# EAGLE design wdt (EAGLE 7.2.0)
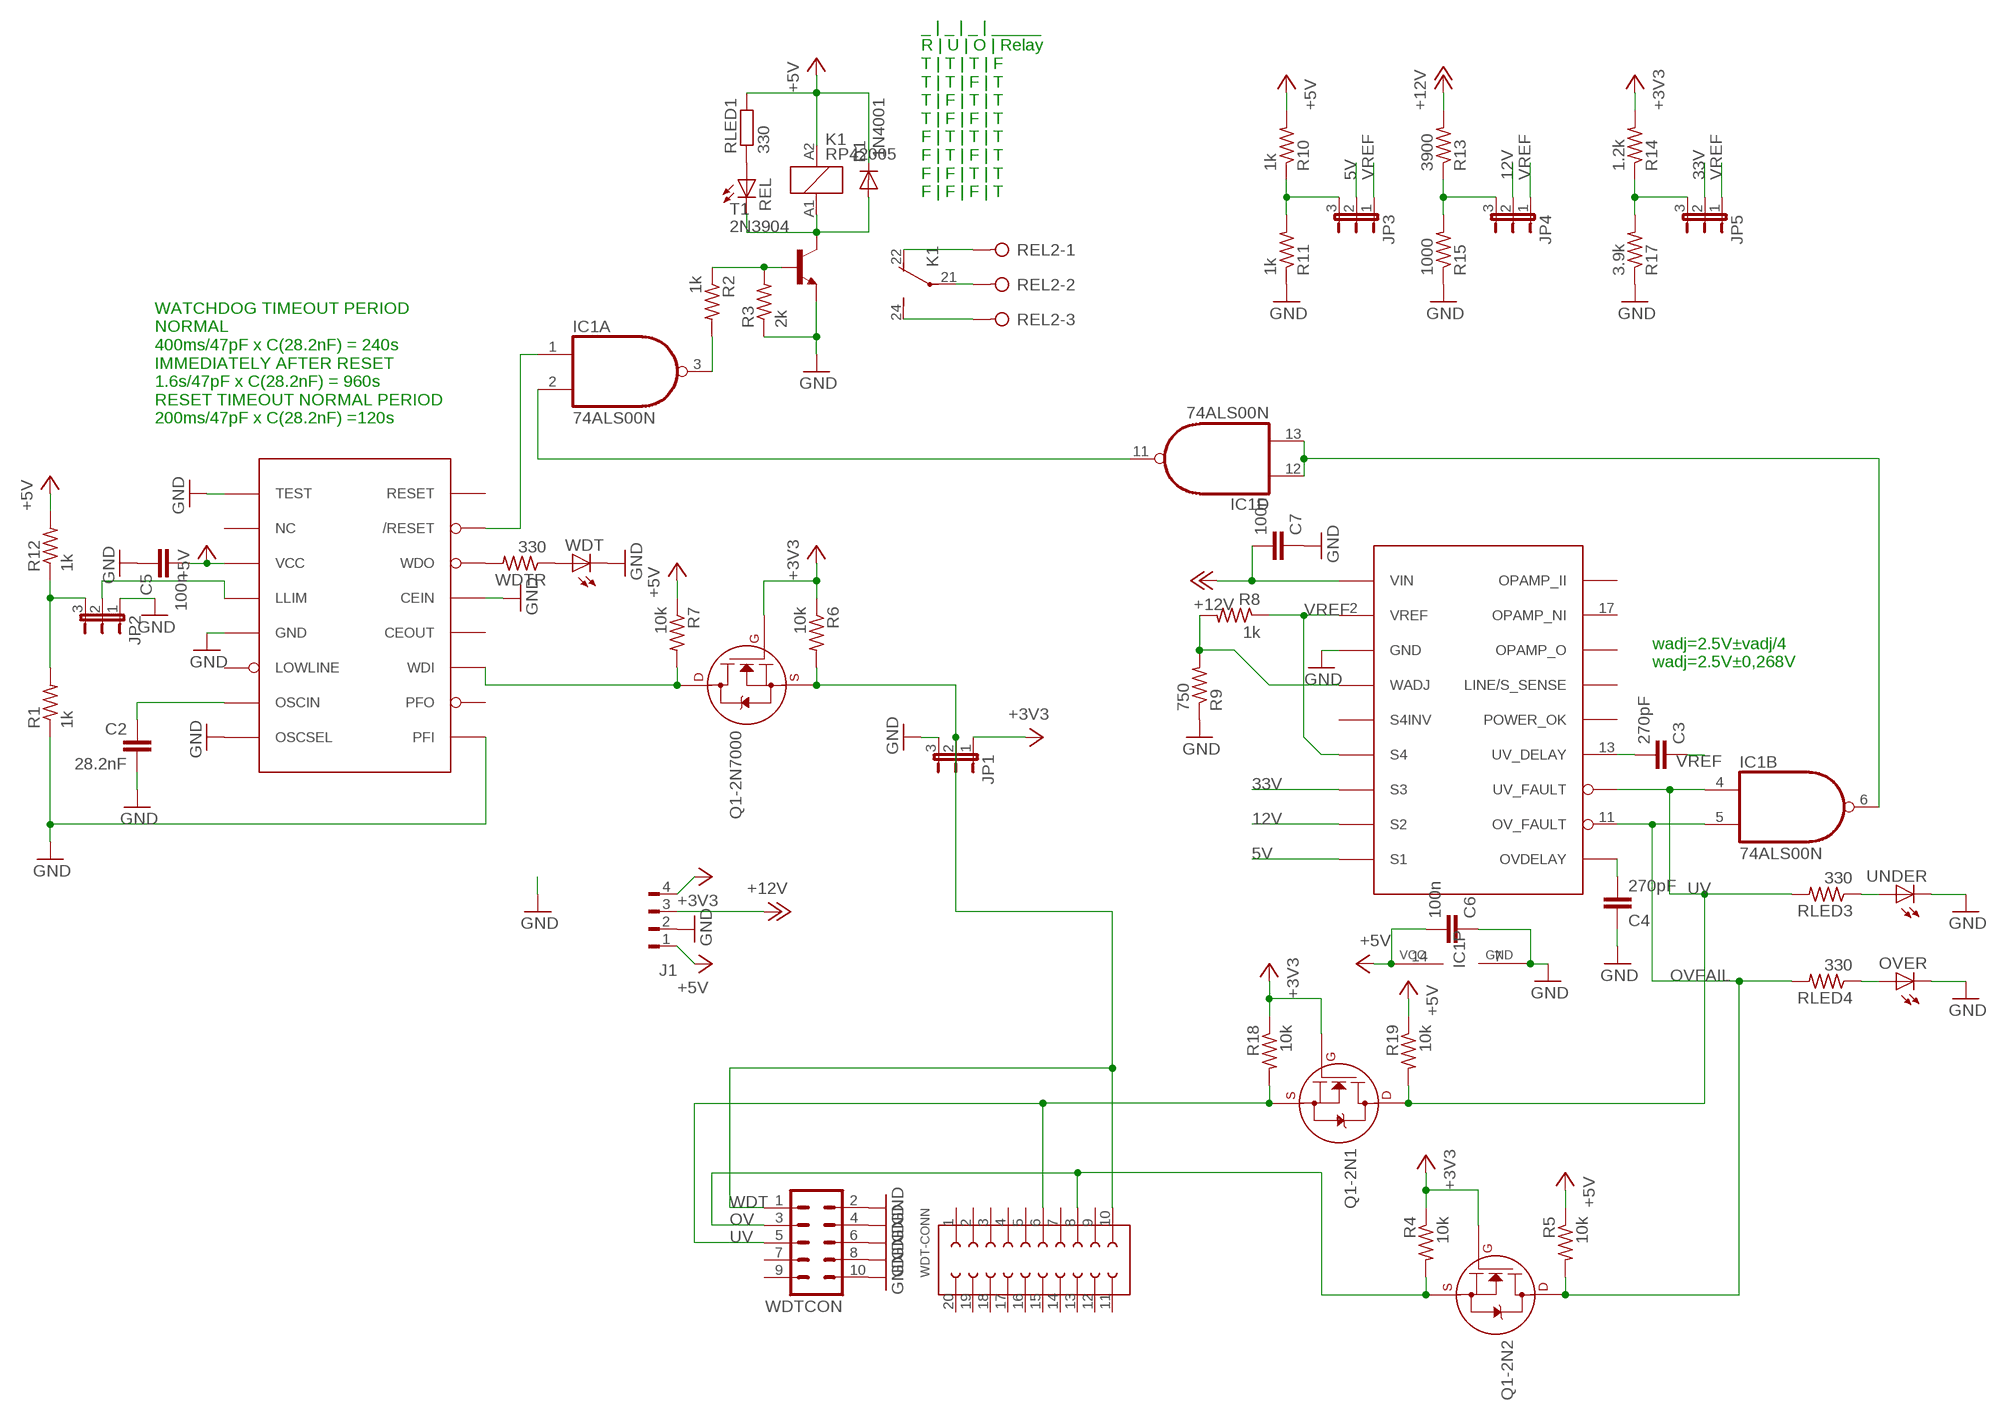
[diagram p0: schematic, sheet 1]

## Parts
C2  28.2nF  C-EU050-025X075  [C050-025X075]
C3  270pF  C-EU050-025X075  [C050-025X075]
C4  270pF  C-EU050-025X075  [C050-025X075]
C5  100n  C-EU050-025X075  [C050-025X075]
C6  100n  C-EU050-025X075  [C050-025X075]
C7  100n  C-EU050-025X075  [C050-025X075]
D1  1N4001  1N4004  [DO41-10]
IC1  74ALS00N  [DIL14]
J1  FLOP-4W827001  [827001]
JP1  JP2E  [JP2]
JP2  JP2E  [JP2]
JP3  JP2E  [JP2]
JP4  JP2E  [JP2]
JP5  JP2E  [JP2]
K1  RP42005  RP420024  [RP420]
OVER  LED3MM  [LED3MM]
Q1-2N1  2N7000_TO92  [TO-92]
Q1-2N2  2N7000_TO92  [TO-92]
Q1-2N7000  2N7000_TO92  [TO-92]
R1  1k  R-US_0207/10  [0207/10]
R2  1k  R-US_0207/10  [0207/10]
R3  2k  R-US_0207/10  [0207/10]
R4  10k  R-US_0207/10  [0207/10]
R5  10k  R-US_0207/10  [0207/10]
R6  10k  R-US_0207/10  [0207/10]
R7  10k  R-US_0207/10  [0207/10]
R8  1k  R-US_0207/10  [0207/10]
R9  750  R-US_0207/10  [0207/10]
R10  1k  R-US_0207/10  [0207/10]
R11  1k  R-US_0207/10  [0207/10]
R12  1k  R-US_0207/10  [0207/10]
R13  3900  R-US_0207/10  [0207/10]
R14  1.2k  R-US_0207/10  [0207/10]
R15  1000  R-US_0207/10  [0207/10]
R17  3.9k  R-US_0207/10  [0207/10]
R18  10k  R-US_0207/10  [0207/10]
R19  10k  R-US_0207/10  [0207/10]
REL  LED3MM  [LED3MM]
REL2  W237-3E  [W237-3E]
RLED1  330  R-EU_0207/10  [0207/10]
RLED3  330  R-US_0207/10  [0207/10]
RLED4  330  R-US_0207/10  [0207/10]
T1  2N3904  [TO92]
U$1  UC3903  [DIL18]
U$2  MAX697  [DIL16]
UNDER  LED3MM  [LED3MM]
WDT  LED3MM  [LED3MM]
WDT-CONN  623X2021021  [623X2021021]
WDTCON  ML10  [ML10]
WDTR  330  R-US_0207/10  [0207/10]

## Nets
5V: JP3.2 U$1.9(S1)
12V: JP4.2 U$1.8(S2)
33V: JP5.2 U$1.7(S3)
+3V3: J1.4 JP1.1 Q1-2N1.2(G) Q1-2N2.2(G) Q1-2N7000.2(G) R4.1 R6.1 R14.2 R18.1
+5V: C5.2 C6.2 D1.C IC1.14(P:VCC) J1.1 K1.A2 R5.1 R7.1 R10.2 R12.2 R19.1 RLED1.2 U$2.3(VCC)
+12V: C7.2 J1.3 R13.2 U$1.1(VIN)
GND: C2.2 C4.1 C5.1 C6.1 C7.1 IC1.7(P:GND) J1.2 JP1.3 JP2.1 OVER.K(C) R1.1 R3.1 R9.1 R11.1 R15.1 R17.1 T1.3(E) U$1.3(GND) U$2.1(TEST) U$2.5(GND) U$2.8(OSCSEL) U$2.9(PFI) U$2.13(CEIN) UNDER.K(C) WDT.K(C) WDTCON.2 WDTCON.4 WDTCON.6 WDTCON.8 WDTCON.10
N$1: Q1-2N7000.3(D) R7.2 U$2.11(WDI)
N$2: D1.A K1.A1 REL.K(C) T1.1(C)
N$3: IC1.1(A:I0) U$2.15(/RESET)
N$5: JP5.3 R14.1 R17.2
N$6: JP2.2 U$2.4(LLIM)
N$7: JP3.3 R10.1 R11.2
N$8: U$2.14(WDO) WDTR.2
N$9: IC1.3(A:O) R2.2
N$12: K1.22(3:O) REL2.1
N$13: R2.1 R3.2 T1.2(B)
N$14: REL.A RLED1.1
N$17: K1.21(3:P) REL2.2
N$18: K1.24(3:S) REL2.3
N$20: R8.2 R9.2 U$1.4(WADJ)
N$24: JP4.3 R13.1 R15.2
N$25: C3.2 U$1.13(UV_DELAY)
N$26: C4.2 U$1.10(OVDELAY)
N$28: IC1.2(A:I1) IC1.11(D:O)
N$30: WDT.A WDTR.1
N$31: C2.1 U$2.7(OSCIN)
N$32: JP2.3 R1.2 R12.1
N$33: IC1.6(B:O) IC1.12(D:I0) IC1.13(D:I1)
N$35: RLED3.1 UNDER.A
N$38: OVER.A RLED4.1
OV: Q1-2N2.1(S) R4.2 WDT-CONN.8 WDTCON.3
OVFAIL: IC1.5(B:I1) Q1-2N2.3(D) R5.2 RLED4.2 U$1.11(OV_FAULT)
UV: IC1.4(B:I0) Q1-2N1.1(S) Q1-2N1.3(D) R18.2 R19.2 RLED3.2 U$1.12(UV_FAULT) WDT-CONN.6 WDTCON.5
VREF: C3.1 JP3.1 JP4.1 JP5.1 R8.1 U$1.2(VREF) U$1.6(S4)
WDT: JP1.2 Q1-2N7000.1(S) R6.2 WDT-CONN.10 WDTCON.1
Unconnected: IC1.8(C:O) IC1.9(C:I0) IC1.10(C:I1) K1.11(2:P) K1.12(2:O) K1.14(2:S) U$1.5(S4INV) U$1.14(POWER_OK) U$1.15(LINE/S_SENSE) U$1.16(OPAMP_O) U$1.17(OPAMP_NI) U$1.18(OPAMP_II) U$2.2(NC) U$2.6(LOWLINE) U$2.10(PFO) U$2.12(CEOUT) U$2.16(RESET) WDT-CONN.1 WDT-CONN.2 WDT-CONN.3 WDT-CONN.4 WDT-CONN.5 WDT-CONN.7 WDT-CONN.9 WDT-CONN.11 WDT-CONN.12 WDT-CONN.13 WDT-CONN.14 WDT-CONN.15 WDT-CONN.16 WDT-CONN.17 WDT-CONN.18 WDT-CONN.19 WDT-CONN.20 WDTCON.7 WDTCON.9

## Notes on the sheet
- _ | _ | _ | _____
  R | U | O | Relay
  T | T | T | F
  T | T | F | T
  T | F | T | T
  T | F | F | T
  F | T | T | T
  F | T | F | T
  F | F | T | T
  F | F | F | T
- WATCHDOG TIMEOUT PERIOD
  NORMAL 
  400ms/47pF x C(28.2nF) = 240s
  IMMEDIATELY AFTER RESET
  1.6s/47pF x C(28.2nF) = 960s
  RESET TIMEOUT NORMAL PERIOD
  200ms/47pF x C(28.2nF) =120s
- wadj=2.5V±vadj/4
  wadj=2.5V±0,268V

## Library data of the parts
C2-C7 = rcl:C-EU: CAPACITOR, European symbol
D1 = diode:1N4004: DIODE general purpose rectifier, 1 A
IC1 = 74xx-us:74*00: Quad 2-input NAND gate
J1 = con-amp:FLOP-4W: MATE N-LOCK Floppy / HDD conector Distributor: Bürklin 71F972
JP1-JP5 = jumper:JP2E: JUMPER
K1 = relay:RP42?*: Power PCB Relay RP II/2 Schrack 2 pole 8 A Source: http://www.schrack.com/.. 5844.pdf; MF: TYCO ELECTRONICS; MPN: RP420024; OC_FARNELL: 1703720; OC_NEWARK: 51B969
OVER REL UNDER WDT = led:LED: LED OSRAM: - CHIPLED LG R971, LG N971, LY N971, LG Q971, LY Q971, LO R971, LY R971 LH N974, LH R974 LS Q976, LO Q976, LY Q976 LO Q996 - Hyper CHIPLED LW Q18S LB Q993, LB Q99A, LB R99A - SideLED LS A670, LO A670, LY A670, LG A670, LP A670 LB A673, LV A673, LT A673, LW A673 LH A674 LY A675 LS A676, LA A676, LO A676, LY A676, LW A676 LS A679, LY A679, LG A679 - Hyper Micro SIDELED® LS Y876, LA Y876, LO Y876, LY Y876 LT Y87S - SmartLED LW L88C, LW L88S LB L89C, LB L89S, LG L890 LS L89K, LO L89K, LY L89K LS L896, LA L896, LO L896, LY L896 - TOPLED LS T670, LO T670, LY T670, LG T670, LP T670 LSG T670, LSP T670, LSY T670, LOP T670, LYG T670 LG T671, LOG T671, LSG T671 LB T673, LV T673, LT T673, LW T673 LH T674 LS T676, LA T676, LO T676, LY T676, LB T676, LH T676, LSB T676, LW T676 LB T67C, LV T67C, LT T67C, LS T67K, LO T67K, LY T67K, LW E67C LS E67B, LA E67B, LO E67B, LY E67B, LB E67C, LV E67C, LT E67C LW T67C LS T679, LY T679, LG T679 LS T770, LO T770, LY T770, LG T770, LP T770 LB T773, LV T773, LT T773, LW T773 LH T774 LS E675, LA E675, LY E675, LS T675 LS T776, LA T776, LO T776, LY T776, LB T776 LHGB T686 LT T68C, LB T68C - Hyper Mini TOPLED® LB M676 - Mini TOPLED Santana® LG M470 LS M47K, LO M47K, LY M47K Source: http://www.osram.convergy.de LUXEON: - LUMILED® LXK2-PW12-R00, LXK2-PW12-S00, LXK2-PW14-U00, LXK2-PW14-V00 LXK2-PM12-R00, LXK2-PM12-S00, LXK2-PM14-U00 LXK2-PE12-Q00, LXK2-PE12-R00, LXK2-PE12-S00, LXK2-PE14-T00, LXK2-PE14-U00 LXK2-PB12-K00, LXK2-PB12-L00, LXK2-PB12-M00, LXK2-PB14-N00, LXK2-PB14-P00, LXK2-PB14-Q00 LXK2-PR12-L00, LXK2-PR12-M00, LXK2-PR14-Q00, LXK2-PR14-R00 LXK2-PD12-Q00, LXK2-PD12-R00, LXK2-PD12-S00 LXK2-PH12-R00, LXK2-PH12-S00 LXK2-PL12-P00, LXK2-PL12-Q00, LXK2-PL12-R00 Source: www.luxeon.com KINGBRIGHT: KA-3528ASYC Source: www.kingbright.com
Q1-2N1 Q1-2N2 Q1-2N7000 = mosfet:2N700*: 2N7000, 2N7002, NDS7002A N-channel enhancement mode MOSFET
R1-R15 R17-R19 RLED3 RLED4 WDTR = rcl:R-US_: RESISTOR, American symbol
REL2 = con-wago-508:W237-3E: WAGO SREW CLAMP; OC_FARNELL: unknown; OC_NEWARK: unknown
RLED1 = rcl:R-EU_: RESISTOR, European symbol
T1 = transistor:2N3904: NPN TRANSISTOR
U$1 = texas:UC3903
U$2 = ic-package:MAX697
WDT-CONN = Wurth_Elektronik_Electromechanic_Board_to_Board_Connectors_rev16a:623X2021021: WR-PHD 1.27mm Dual SMT Socket Header H=4.50mm, 20 Pins=>Code : Con_BTB_SHD_1.27_2_623x2021021(Packaging:x = 0: Tube x = 3: Tape & Reel with Cap) <http://katalog.we-online.de/media/thumbs2/eican/thb_Con_BTB_SHD_1.27_2_6230xx21021_pf2.jpg> 6230xx21021 Details see: http://katalog.we-online.de/en/em/623_0xx_210_21 6233xx21021 Details see: http://katalog.we-online.de/en/em/PHD_1_27_SMT_DUAL_SOCKET_HEADER_REEL_6233XX21021 2014 (C) Würth Elektronik
WDTCON = con-ml:ML10: HARTING; OC_FARNELL: unknown; OC_NEWARK: unknown

## Board
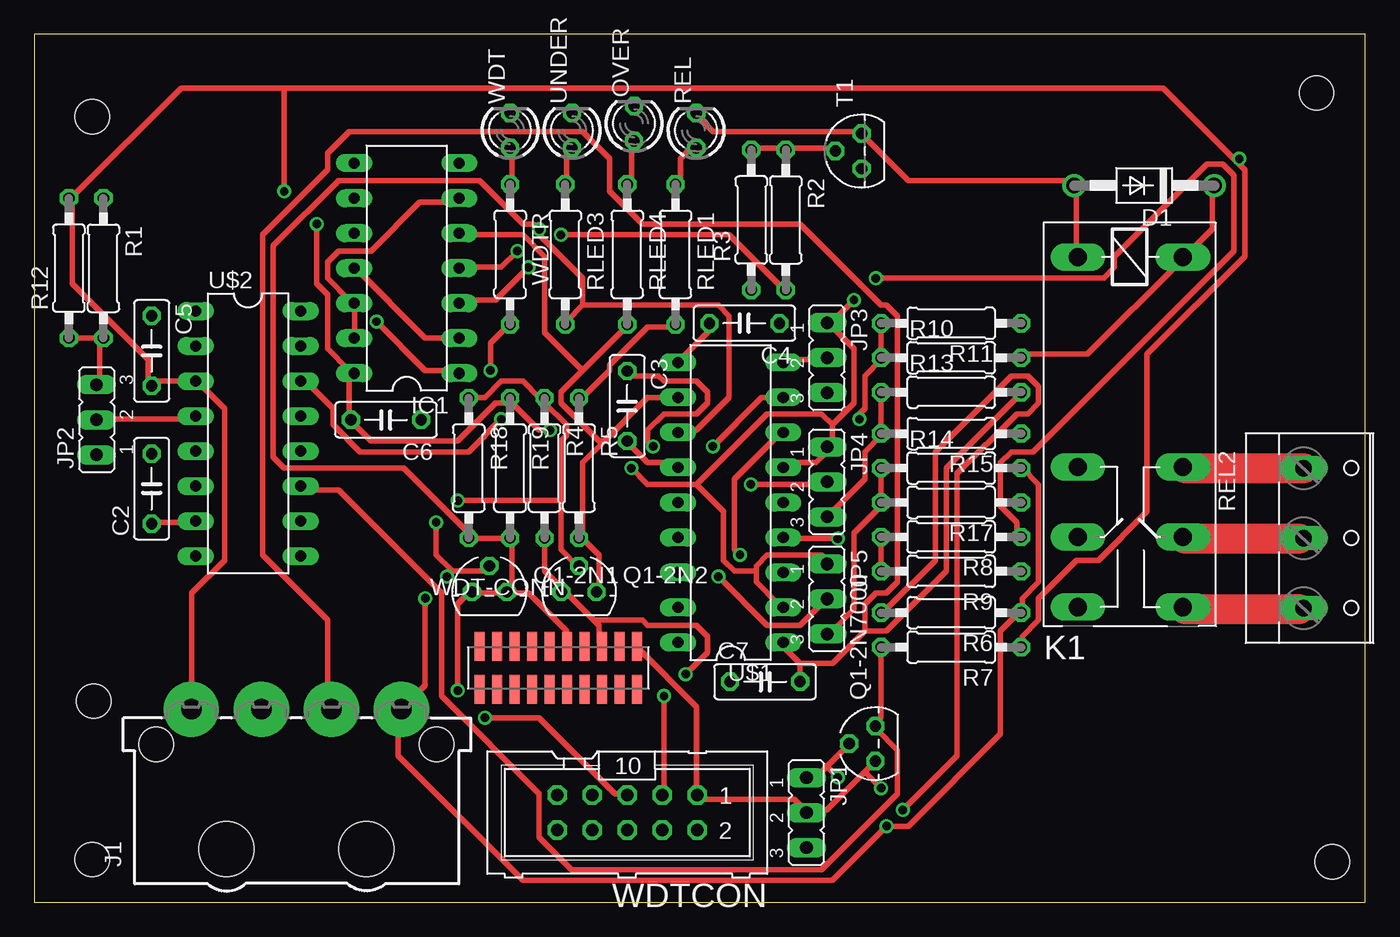
[diagram p1: board, top side]
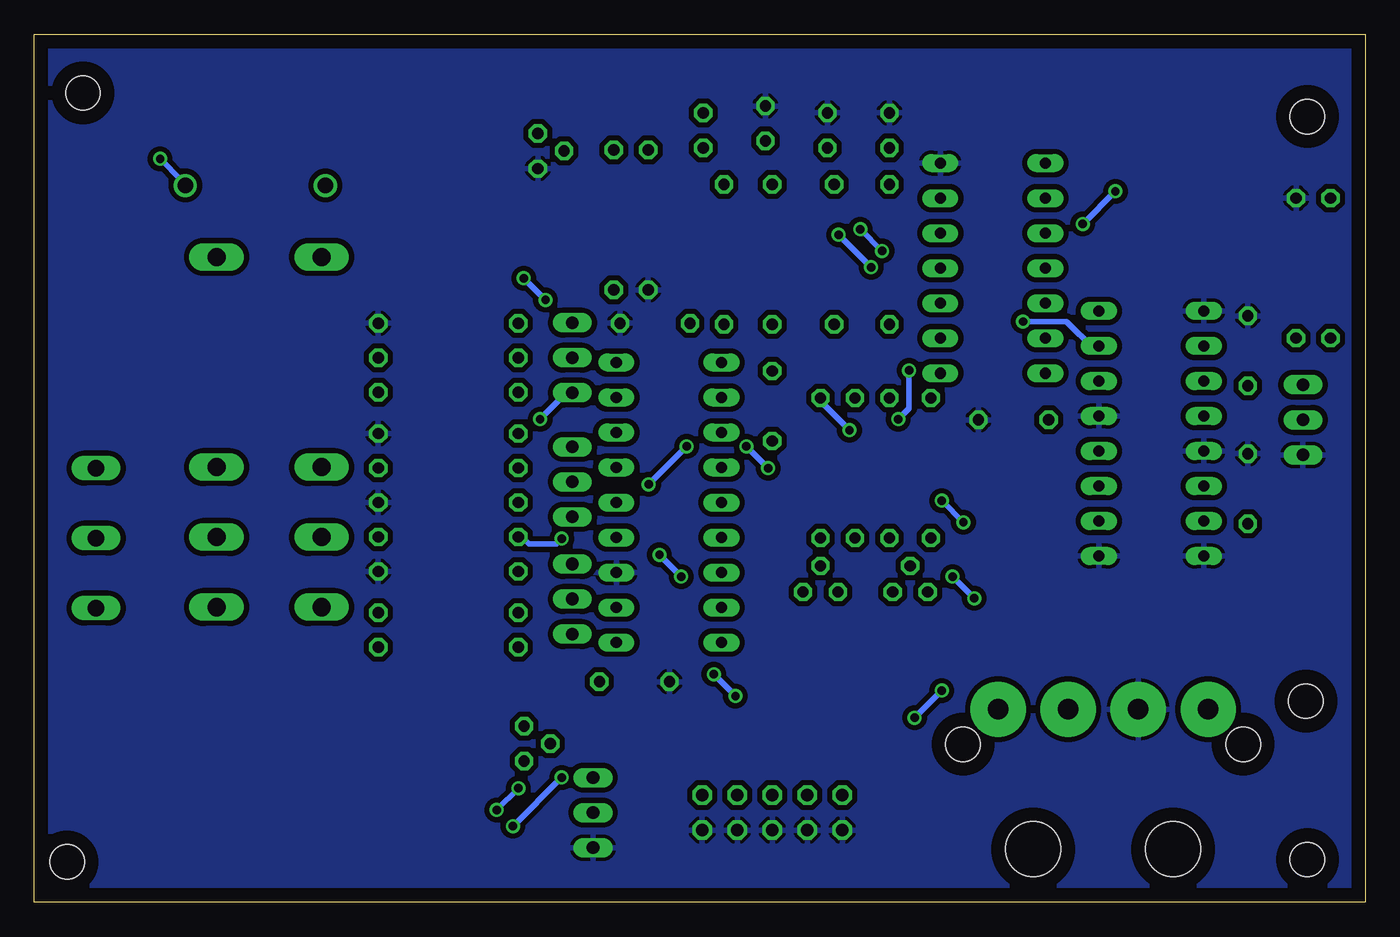
[diagram p2: board, bottom side, seen from below]

Size 96.52 x 62.96 mm. Coordinates in mm from the lower left corner, seen from the top.
Outline: 0,0 96.52,0 96.52,62.96 0,62.96 0,0
Copper layers (1*16): Top 0.035mm / dielectric 1.5mm / Bottom 0.035mm
Design rules "default *": minimum track width 16mil, minimum drill 24mil, track to track 15mil, track to pad 12mil, pad to pad 12mil, via to via 12mil, smd to smd 8mil, copper to edge 40mil, drill to drill 8mil, minimum pad ring 10mil, minimum via ring 8mil, stop-mask expansion 4mil, vias tented up to drill 0mil, thermal gap 10mil
Holes 2.5 mm at 93,58.72 4.18,3.1 4.18,57 94.15,2.92 4.3,14.58

### Footprints (pad centres in the part's own frame; a part is rotated, then mirrored left to right if it is on the bottom)
C050-025X075 = drill 0.813 octagon: 1 -2.54,0; 2 2.54,0
DO41-10 = drill 1.118: A 5.08,0; C -5.08,0
DIL14 = drill 0.813 long: 1 -7.62,-3.81; 2 -5.08,-3.81; 3 -2.54,-3.81; 4 0,-3.81; 5 2.54,-3.81; 6 5.08,-3.81; 7 7.62,-3.81; 8 7.62,3.81; 9 5.08,3.81; 10 2.54,3.81; 11 0,3.81; 12 -2.54,3.81; 13 -5.08,3.81; 14 -7.62,3.81
827001 = drill 1.5 pad 4: 1 -7.62,0; 2 -2.54,0; 3 2.54,0; 4 7.62,0 | hole 4: 5.08,-10.16; -5.08,-10.16 | hole 2.5: 10.16,-2.54; -10.16,-2.54
JP2 = drill 0.914 long: 1 -2.54,0; 2 0,0; 3 2.54,0
RP420 = drill 1.321 long: 11 16.51,-3.81; 12 11.43,-3.81; 14 21.59,-3.81; 21 16.51,3.81; 22 11.43,3.81; 24 21.59,3.81; A1 -3.81,-3.81; A2 -3.81,3.81
LED3MM = drill 0.813 octagon: A -1.27,0; K 1.27,0
TO-92 = drill 0.813 octagon: 1 -1.27,0; 2 0,1.905; 3 1.27,0
0207/10 = drill 0.813 octagon: 1 -5.08,0; 2 5.08,0
W237-3E = drill 1.194 long: 1 -5.08,-0.635; 2 0,-0.635; 3 5.08,-0.635
TO92 = drill 0.813 octagon: 1 1.27,0; 2 0,1.905; 3 -1.27,0
DIL18 = drill 0.813 long: 1 -10.16,-3.81; 2 -7.62,-3.81; 3 -5.08,-3.81; 4 -2.54,-3.81; 5 0,-3.81; 6 2.54,-3.81; 7 5.08,-3.81; 8 7.62,-3.81; 9 10.16,-3.81; 10 10.16,3.81; 11 7.62,3.81; 12 5.08,3.81; 13 2.54,3.81; 14 0,3.81; 15 -2.54,3.81; 16 -5.08,3.81; 17 -7.62,3.81; 18 -10.16,3.81
DIL16 = drill 0.813 long: 1 -8.89,-3.81; 2 -6.35,-3.81; 3 -3.81,-3.81; 4 -1.27,-3.81; 5 1.27,-3.81; 6 3.81,-3.81; 7 6.35,-3.81; 8 8.89,-3.81; 9 8.89,3.81; 10 6.35,3.81; 11 3.81,3.81; 12 1.27,3.81; 13 -1.27,3.81; 14 -3.81,3.81; 15 -6.35,3.81; 16 -8.89,3.81
623X2021021 = smd 0.75 x 2.1: 1 -5.715,1.55; 2 -4.445,1.55; 3 -3.175,1.55; 4 -1.905,1.55; 5 -0.635,1.55; 6 0.635,1.55; 7 1.905,1.55; 8 3.175,1.55; 9 4.445,1.55; 10 5.715,1.55; 11 5.715,-1.55; 12 4.445,-1.55; 13 3.175,-1.55; 14 1.905,-1.55; 15 0.635,-1.55; 16 -0.635,-1.55; 17 -1.905,-1.55; 18 -3.175,-1.55; 19 -4.445,-1.55; 20 -5.715,-1.55
ML10 = drill 0.914 octagon: 1 -5.08,-1.27; 2 -5.08,1.27; 3 -2.54,-1.27; 4 -2.54,1.27; 5 0,-1.27; 6 0,1.27; 7 2.54,-1.27; 8 2.54,1.27; 9 5.08,-1.27; 10 5.08,1.27

### Placement (x,y rotation side)
C2  8.5,30 90 top
C3  43,36 270 top
C4  51.5,42 180 top
C5  8.5,40 270 top
C6  25.5,35 180 top
C7  53,16 0 top
D1  80.5,52 180 top
IC1  27,46 90 top
J1  19,14 0 top
JP1  56,6.5 270 top
JP2  4.5,35 90 top
JP3  57.5,39.5 270 top
JP4  57.5,30.5 270 top
JP5  57.5,22 270 top
K1  79.5,43 270 top
OVER  43.5,56.5 90 top
Q1-2N1  33,22.5 0 top
Q1-2N2  39.5,22.5 0 top
Q1-2N7000  61,11.5 90 top
R1  5,46 270 top
R2  54.5,49.5 270 top
R3  52,49.5 90 top
R4  37,31.5 270 top
R5  39.5,31.5 270 top
R6  66.5,21 180 top
R7  66.5,18.5 180 top
R8  66.5,26.5 180 top
R9  66.5,24 180 top
R10  66.5,39.5 0 top
R11  66.5,42 180 top
R12  2.5,46 90 top
R13  66.5,37 0 top
R14  66.5,31.5 0 top
R15  66.5,34 180 top
R17  66.5,29 180 top
R18  31.5,31.5 270 top
R19  34.5,31.5 270 top
REL  48,56 90 top
REL2  92.68,26.42 270 top
RLED1  46.5,47 270 top
RLED3  38.5,47 270 top
RLED4  43,47 270 top
T1  60,54.5 90 top
U$1  50.5,29 90 top
U$2  15.5,34 270 top
UNDER  39,56 90 top
WDT  34.5,56 90 top
WDT-CONN  38,17 0 top
WDTCON  43,6.5 180 top
WDTR  34.5,47 270 top

### Tracks (layer width: path | path; a pad name or v marks a point on that pad's centre or on a via)
5V
  Top 0.406: U$1.9 54.33,39.37 57.48,39.37 JP3.2
12V  (via drill 0.61)
  Top 0.406: v49.21,33.07 52.76,36.61 53.94,36.61 U$1.8 | v51.97,30.32 57.48,30.32 JP4.2
  Bottom 0.406: v51.97,30.32 v49.21,33.07
33V  (via drill 0.61)
  Top 0.406: v51.18,25.2 50.79,25.59 50.79,30.71 53.94,33.86 U$1.7 | v49.61,23.62 53.15,20.08 55.51,20.08 57.48,22.05 JP5.2
  Bottom 0.406: v49.61,23.62 v51.18,25.2
+3V3  (via drill 0.61)
  Top 0.406: 57.48,9.84 56.3,8.66 JP1.1 | 57.48,9.84 59.05,11.42 Q1-2N7000.2 | R14.2 71.65,31.5 72.83,30.32 72.83,23.23 71.65,22.05 71.65,21.26 R6.1 71.26,20.87 70.08,19.68 70.08,12.21 63.39,5.51 v61.81,5.51 57.87,1.57 35.43,1.57 26.38,10.63 26.38,13.78 J1.4 26.77,14.17 28.35,15.75 v28.35,22.05 | v58.27,9.05 57.48,9.84 | R18.1 31.89,36.61 32.68,36.61 33.86,37.8 35.43,37.8 36.61,36.61 R4.1 37.01,36.22 38.58,34.65 38.58,33.86 38.19,33.47 38.19,29.13 | 38.19,29.13 38.19,25.59 39.37,24.41 Q1-2N2.2 | 30.32,24.02 32.68,24.02 Q1-2N1.2 | v29.92,23.62 30.32,24.02 | v30.71,29.13 38.19,29.13 | v29.13,27.56 29.13,25.2 30.32,24.02
  Bottom 0.406: v61.81,5.51 v58.27,9.05 | v28.35,22.05 v29.92,23.62 | v29.13,27.56 v30.71,29.13
+5V  (via drill 0.61)
  Top 0.406: R5.1 39.76,36.61 41.73,38.58 41.73,38.98 44.49,41.73 46.46,41.73 RLED1.2 | v37.4,34.25 36.61,34.25 34.65,36.22 R19.1 34.25,36.22 33.47,36.22 30.71,33.47 24.41,33.47 23.23,34.65 C6.2 22.84,35.04 22.84,38.19 IC1.14 22.84,38.58 21.26,40.16 21.26,44.09 20.47,44.88 v20.47,49.21 | R10.2 71.65,39.76 76.38,39.76 83.07,46.46 K1.A2 83.46,46.85 85.43,48.82 85.43,51.97 D1.C | 87.01,53.94 81.89,59.05 18.11,59.05 | 87.01,53.94 87.8,53.15 87.8,46.85 80.71,39.76 80.71,28.35 77.17,24.8 75.59,24.8 72.83,22.05 72.83,20.47 71.65,19.29 71.65,18.5 R7.1 | 18.11,59.05 10.63,59.05 2.76,51.18 R12.2 2.76,50.79 2.76,44.88 8.27,39.37 8.27,37.8 C5.2 8.66,37.8 11.42,37.8 U$2.3 11.81,37.8 13.78,35.83 13.78,24.8 11.42,22.44 11.42,14.17 J1.1 | 87.01,53.94 v87.4,53.94 | 18.11,59.05 v18.11,51.58
  Bottom 0.406: v37.4,34.25 39.37,36.22 R5.1 | v87.4,53.94 85.83,52.36 D1.C | v18.11,51.58 v20.47,49.21
+12V
  Top 0.406: 55.51,17.32 55.51,16.14 C7.2 | 55.51,17.32 54.33,18.5 U$1.1 | 60.24,19.68 61.81,19.68 66.14,24.02 66.14,31.5 71.26,36.61 R13.2 | 60.24,19.68 57.87,17.32 55.51,17.32 | 60.24,19.68 60.24,21.65 61.02,22.44 61.81,22.44 62.6,23.23 62.6,42.52 61.81,43.31 61.42,43.31 55.51,49.21 44.09,49.21 41.73,51.58 41.73,53.94 39.76,55.91 22.84,55.91 21.26,54.33 21.26,53.15 16.54,48.42 16.54,25.2 21.26,20.47 21.26,14.17 J1.3
GND
  pour Bottom (isolate 0.305): -0.18,63.5 99.06,63.5 99.06,-0.64 -0.64,-0.64
N$1
  Top 0.406: U$2.11 19.68,29.92 22.05,29.92 29.53,22.44 29.53,14.96 36.61,7.87 36.61,4.72 38.98,2.36 57.09,2.36 62.6,7.87 62.6,11.02 61.02,12.6 Q1-2N7000.3 61.02,12.99 61.42,13.39 61.42,18.11 R7.2
N$2
  Top 0.406: K1.A1 75.59,46.85 75.59,51.97 D1.A 75.2,52.36 63.39,52.36 60.24,55.51 T1.1 59.84,55.91 49.21,55.91 48.03,57.09 REL.K
N$3  (via drill 0.61)
  Top 0.406: v24.8,42.13 28.35,38.58 30.71,38.58 IC1.1
  Bottom 0.406: v24.8,42.13 21.65,42.13 19.68,40.16 U$2.15
N$5
  Top 0.406: R14.1 61.42,29.13 R17.2 61.42,28.74 59.45,26.77 59.45,21.26 57.87,19.68 JP5.3
N$6
  Top 0.406: U$2.4 11.42,35.04 4.72,35.04 JP2.2
N$7  (via drill 0.61)
  Top 0.406: R11.2 61.42,41.73 61.42,39.76 R10.1 61.42,39.37 60.24,38.19 60.24,35.83 59.84,35.43 v59.84,35.04
  Bottom 0.406: v59.84,35.04 58.27,36.61 57.87,36.61 JP3.3
N$8  (via drill 0.61)
  Top 0.406: v33.86,35.04 31.5,32.68 23.62,32.68 21.65,34.65 21.65,35.83 19.68,37.8 U$2.14 | v33.07,38.58 33.07,40.55 34.25,41.73 WDTR.2
  Bottom 0.406: v33.86,35.04 33.07,35.83 v33.07,38.58
N$9  (via drill 0.61)
  Top 0.406: v35.83,46.06 33.47,43.7 31.1,43.7 IC1.3 | v38.19,48.42 50.39,48.42 54.33,44.49 R2.2
  Bottom 0.406: v38.19,48.42 v35.83,46.06
N$12
  Top 0.406: 83.46,31.5 K1.22
  Top 2.184: 83.46,31.5 REL2.1
N$13
  Top 0.406: R3.2 52.36,54.72 54.33,54.72 R2.1 54.72,54.72 57.87,54.72 T1.2
N$14
  Top 0.406: RLED1.1 46.85,52.36 46.85,53.94 47.64,54.72 REL.A
N$17
  Top 0.406: 91.73,26.38 REL2.2 | 83.46,26.38 K1.21
  Top 2.184: 83.46,26.38 91.73,26.38
N$18
  Top 0.406: 91.73,21.26 REL2.3 | 83.46,21.26 K1.24
  Top 2.184: 83.46,21.26 91.73,21.26
N$20  (via drill 0.61)
  Top 0.406: R9.2 61.42,24.02 61.42,26.38 R8.2 | v58.27,26.38 54.33,26.38 U$1.4
  Bottom 0.406: v58.27,26.38 58.66,25.98 60.63,25.98 61.42,26.77 R8.2
N$24
  Top 0.406: R13.1 61.42,36.61 61.42,34.25 R15.2 61.42,33.86 60.24,32.68 60.24,30.71 57.87,28.35 JP4.3
N$25
  Top 0.406: U$1.13 46.46,31.89 44.49,31.89 43.31,33.07 C3.2
N$26
  Top 0.406: U$1.10 46.85,39.37 49.21,41.73 C4.2
N$28
  Top 0.406: IC1.2 30.71,40.95 28.35,40.95 23.23,46.06 IC1.11
N$30
  Top 0.406: WDTR.1 34.65,52.36 34.65,54.72 WDT.A
N$31
  Top 0.406: C2.1 8.66,27.56 11.42,27.56 U$2.7
N$32
  Top 0.406: R12.1 2.76,40.95 4.72,40.95 R1.2 4.72,40.55 4.72,37.8 JP2.3
N$33
  Top 0.406: IC1.13 23.23,40.95 23.23,43.31 IC1.12 22.84,43.7 21.26,45.28 21.26,46.46 22.05,47.24 24.41,47.24 27.95,50.79 30.71,50.79 IC1.6
N$35
  Top 0.406: RLED3.1 38.58,52.36 38.58,54.33 38.98,54.72 UNDER.A
N$38
  Top 0.406: RLED4.1 43.31,52.36 43.31,55.12 OVER.A
OV  (via drill 0.61)
  Top 0.406: 40.55,20.47 38.58,22.44 Q1-2N2.1 38.19,22.84 37.01,24.02 37.01,26.38 R4.2 | 40.55,20.47 40.95,20.08 40.95,18.9 WDT-CONN.8 | v45.67,14.96 45.67,7.87 WDTCON.3 | v47.24,16.54 48.82,18.11 48.82,19.29 48.03,20.08 44.49,20.08 44.09,20.47 40.55,20.47
  Bottom 0.406: v47.24,16.54 v45.67,14.96
OVFAIL
  Top 0.406: Q1-2N2.3 40.95,22.84 40.95,25.2 39.76,26.38 R5.2 39.76,26.77 39.76,31.89 41.34,33.47 | 41.34,33.47 44.49,36.61 46.46,36.61 U$1.11 | 39.76,38.58 38.19,37.01 38.19,36.22 40.95,33.47 41.34,33.47 | 39.76,38.58 42.91,41.73 RLED4.2 | 39.76,38.58 37.01,41.34 37.01,46.85 35.43,48.42 31.1,48.42 IC1.5
UV  (via drill 0.61)
  Top 0.406: WDT-CONN.6 38.58,18.9 38.58,19.68 35.83,22.44 34.65,22.44 Q1-2N1.3 | Q1-2N1.3 34.25,22.44 31.89,22.44 Q1-2N1.1 31.5,22.44 30.71,21.65 v30.71,15.35 | v32.68,13.39 36.61,13.39 42.13,7.87 42.91,7.87 WDTCON.5 | Q1-2N1.3 34.65,22.84 34.65,26.38 R19.2 34.25,26.38 31.89,26.38 R18.2 31.5,26.77 26.77,31.5 18.11,31.5 17.32,32.28 17.32,47.64 22.05,52.36 32.28,52.36 35.43,49.21 36.22,49.21 v36.61,48.82 36.61,48.42 39.76,45.28 39.76,43.31 | 39.76,43.31 49.61,43.31 50.39,42.52 50.39,36.61 48.03,34.25 46.85,34.25 U$1.12 | 39.76,43.31 38.58,42.13 RLED3.2 | v35.04,47.24 33.86,46.06 31.1,46.06 IC1.4
  Bottom 0.406: v30.71,15.35 v32.68,13.39 | v36.61,48.82 v35.04,47.24
VREF  (via drill 0.61)
  Top 0.406: 52.36,24.02 52.36,24.41 53.15,25.2 57.09,25.2 57.48,24.8 JP5.1 | 52.36,24.02 52.36,23.23 53.94,21.65 U$1.2 | v44.88,33.07 44.49,33.47 44.49,34.25 45.67,35.43 48.03,35.43 48.82,36.22 48.82,37.01 48.03,37.8 45.67,37.8 45.28,38.19 43.31,38.19 C3.1 | v43.31,31.5 44.49,30.32 48.03,30.32 | 48.03,30.32 50,28.35 50,24.8 50.79,24.02 52.36,24.02 | U$1.6 54.33,31.89 56.69,31.89 57.48,32.68 JP4.1 57.87,33.07 57.87,34.65 | v61.02,45.28 77.56,45.28 78.35,46.06 78.35,46.85 85.04,53.54 86.22,53.54 87.01,52.76 87.01,47.24 72.44,32.68 70.87,32.68 70.08,31.89 70.08,28.74 71.26,27.56 71.26,26.77 R8.1 | v59.45,43.7 57.87,42.13 JP3.1 57.87,41.73 59.45,40.16 59.45,36.22 57.87,34.65 | 48.03,30.32 53.15,35.43 57.09,35.43 57.87,34.65
  Bottom 0.406: v43.31,31.5 v44.88,33.07 | v59.45,43.7 v61.02,45.28
WDT  (via drill 0.61)
  Top 0.406: WDT-CONN.10 43.7,18.5 48.03,14.17 48.03,7.87 WDTCON.1 48.42,7.48 55.12,7.48 55.91,6.69 JP1.2 56.3,6.69 57.48,6.69 60.24,9.45 | 60.24,9.45 60.63,9.84 Q1-2N7000.1 | v62.99,6.69 66.93,10.63 66.93,31.1 71.26,35.43 72.05,35.43 72.83,36.22 72.83,37.4 72.05,38.19 70.87,38.19 65.35,32.68 65.35,24.8 61.81,21.26 R6.2 | 60.24,9.45 v61.42,8.27
  Bottom 0.406: v61.42,8.27 v62.99,6.69